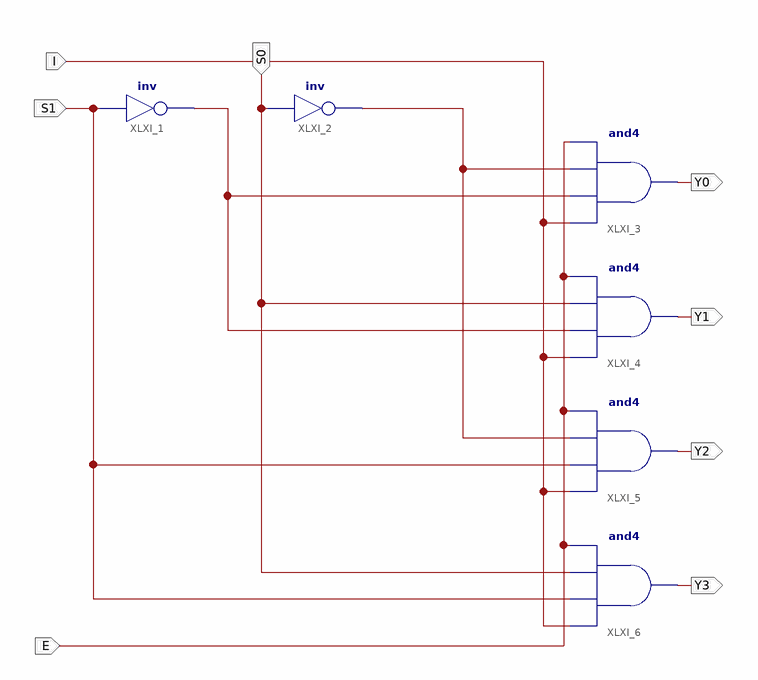
[diagram p0: schematic sheet 1]
// Xilinx ISE schematic DEMUX_1_4.sch (artix7) as structural Verilog: 6 symbols, 8 ports
module DEMUX_1_4 (
  input  S0,
  input  I,
  input  S1,
  input  E,
  output Y0,
  output Y1,
  output Y2,
  output Y3
);

  wire XLXN_7, XLXN_9;

  not XLXI_1 (XLXN_9, S1);
  not XLXI_2 (XLXN_7, S0);
  and XLXI_3 (Y0, I, XLXN_9, XLXN_7, E);
  and XLXI_4 (Y1, I, XLXN_9, S0, E);
  and XLXI_5 (Y2, I, S1, XLXN_7, E);
  and XLXI_6 (Y3, I, S1, S0, E);
endmodule
